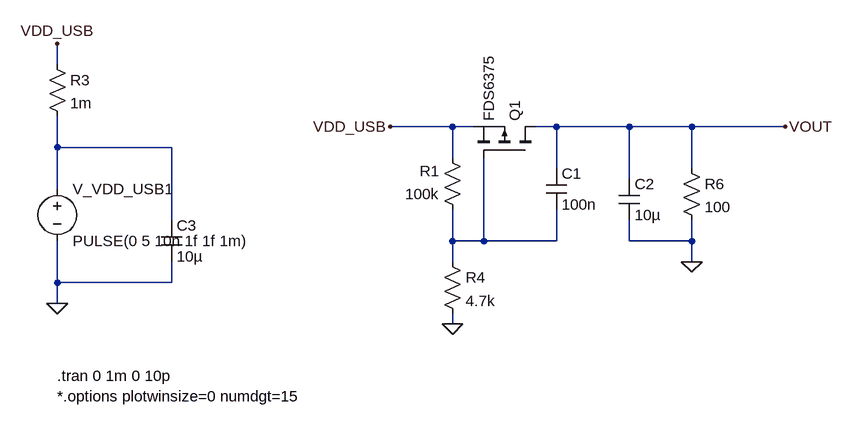
[diagram p0: schematic Schematic.asc]
Schematic.asc, the LTspice schematic file:
Version 4
SHEET 1 1688 864
WIRE -2000 -848 -2000 -880
WIRE -1392 -752 -1488 -752
WIRE -1360 -752 -1392 -752
WIRE -1232 -752 -1264 -752
WIRE -1120 -752 -1232 -752
WIRE -1024 -752 -1120 -752
WIRE -880 -752 -1024 -752
WIRE -2000 -720 -2000 -768
WIRE -1824 -720 -2000 -720
WIRE -1392 -704 -1392 -752
WIRE -1232 -688 -1232 -752
WIRE -1024 -688 -1024 -752
WIRE -1120 -672 -1120 -752
WIRE -2000 -656 -2000 -720
WIRE -1824 -608 -1824 -720
WIRE -1392 -576 -1392 -624
WIRE -1344 -576 -1344 -704
WIRE -1344 -576 -1392 -576
WIRE -1232 -576 -1232 -624
WIRE -1232 -576 -1344 -576
WIRE -1120 -576 -1120 -608
WIRE -1024 -576 -1024 -608
WIRE -1024 -576 -1120 -576
WIRE -1392 -544 -1392 -576
WIRE -1024 -544 -1024 -576
WIRE -2000 -512 -2000 -576
WIRE -1824 -512 -1824 -544
WIRE -1824 -512 -2000 -512
WIRE -2000 -480 -2000 -512
WIRE -1392 -448 -1392 -464
FLAG -2000 -480 0
FLAG -2000 -880 VDD_USB
FLAG -1488 -752 VDD_USB
FLAG -1392 -448 0
FLAG -1024 -544 0
FLAG -880 -752 VOUT
SYMBOL res -2016 -864 R0
SYMATTR InstName R3
SYMATTR Value 1m
SYMBOL cap -1840 -608 R0
SYMATTR InstName C3
SYMATTR Value 10µ
SYMBOL pmos -1264 -704 M270
SYMATTR InstName Q1
SYMATTR Value FDS6375
SYMBOL res -1376 -608 R180
WINDOW 0 36 76 Left 2
WINDOW 3 36 40 Left 2
SYMATTR InstName R1
SYMATTR Value 100k
SYMBOL cap -1248 -688 R0
SYMATTR InstName C1
SYMATTR Value 100n
SYMBOL res -1408 -560 R0
SYMATTR InstName R4
SYMATTR Value 4.7k
SYMBOL res -1040 -704 R0
SYMATTR InstName R6
SYMATTR Value 100
SYMBOL cap -1136 -672 R0
SYMATTR InstName C2
SYMATTR Value 10µ
SYMBOL voltage -2000 -672 R0
SYMATTR InstName V_VDD_USB1
SYMATTR Value PULSE(0 5 10n 1f 1f 1m)
TEXT -2000 -368 Left 2 !.tran 0 1m 0 10p\n*.options plotwinsize=0 numdgt=15

The netlist it stands for:
* Schematic.asc
R3 VDD_USB N001 1m
C3 N001 0 10µ
M§Q1 VOUT N002 VDD_USB VDD_USB FDS6375
R1 N002 VDD_USB 100k
C1 VOUT N002 100n
R4 N002 0 4.7k
R6 VOUT 0 100
C2 VOUT 0 10µ
V_VDD_USB1 N001 0 PULSE(0 5 10n 1f 1f 1m)
.model NMOS NMOS
.model PMOS PMOS
.lib standard.mos
.tran 0 1m 0 10p
*.options plotwinsize=0 numdgt=15
.backanno
.end